# EAGLE schematic rectifier_schematic (EAGLE 9.6.2)
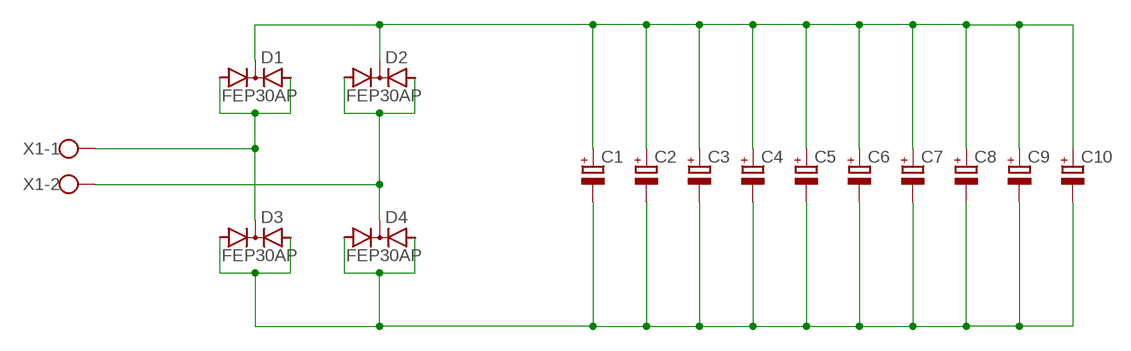
[diagram p0: schematic, sheet 1]

## Parts
C1  CPOL-EUE7.5-18  [E7,5-18]
C2  CPOL-EUE7.5-18  [E7,5-18]
C3  CPOL-EUE7.5-18  [E7,5-18]
C4  CPOL-EUE7.5-18  [E7,5-18]
C5  CPOL-EUE7.5-18  [E7,5-18]
C6  CPOL-EUE7.5-18  [E7,5-18]
C7  CPOL-EUE7.5-18  [E7,5-18]
C8  CPOL-EUE7.5-18  [E7,5-18]
C9  CPOL-EUE7.5-18  [E7,5-18]
C10  CPOL-EUE7.5-18  [E7,5-18]
D1  FEP30AP  [TO3P]
D2  FEP30AP  [TO3P]
D3  FEP30AP  [TO3P]
D4  FEP30AP  [TO3P]
X1  W237-102  [W237-102]

## Nets
N$1: D1.1(A1) D1.3(A2) D3.2(C) X1.1
N$2: D2.1(A1) D2.3(A2) D4.2(C) X1.2
N$4: C1.- C2.- C3.- C4.- C5.- C6.- C7.- C8.- C9.- C10.- D3.1(A1) D3.3(A2) D4.1(A1) D4.3(A2)
N$5: C1.+ C2.+ C3.+ C4.+ C5.+ C6.+ C7.+ C8.+ C9.+ C10.+ D1.2(C) D2.2(C)

## Library data of the parts
C1-C10 = rcl:CPOL-EU: POLARIZED CAPACITOR, European symbol; SPICEPREFIX: C
D1-D4 = diode:FEP30AP: DIODE dual ultra-fast recovery rectifier, common cathode
X1 = con-wago-500:W237-102: WAGO SCREW CLAMP; MPN: 237-102; OC_FARNELL: unknown; OC_NEWARK: 70K9898